# EasyEDA Pro project ProPrj_CLOCK_2026-02-21.epro

# Schematic Schematic1
Board Name: Board1; Create Date: 2025-11-06; Page Name: P1; Project Name: CLOCK; Schematic Name: Schematic1; Update Date: 2025-11-06; Company: EasyEDA.com; Page Size: A4; Version: V1.0
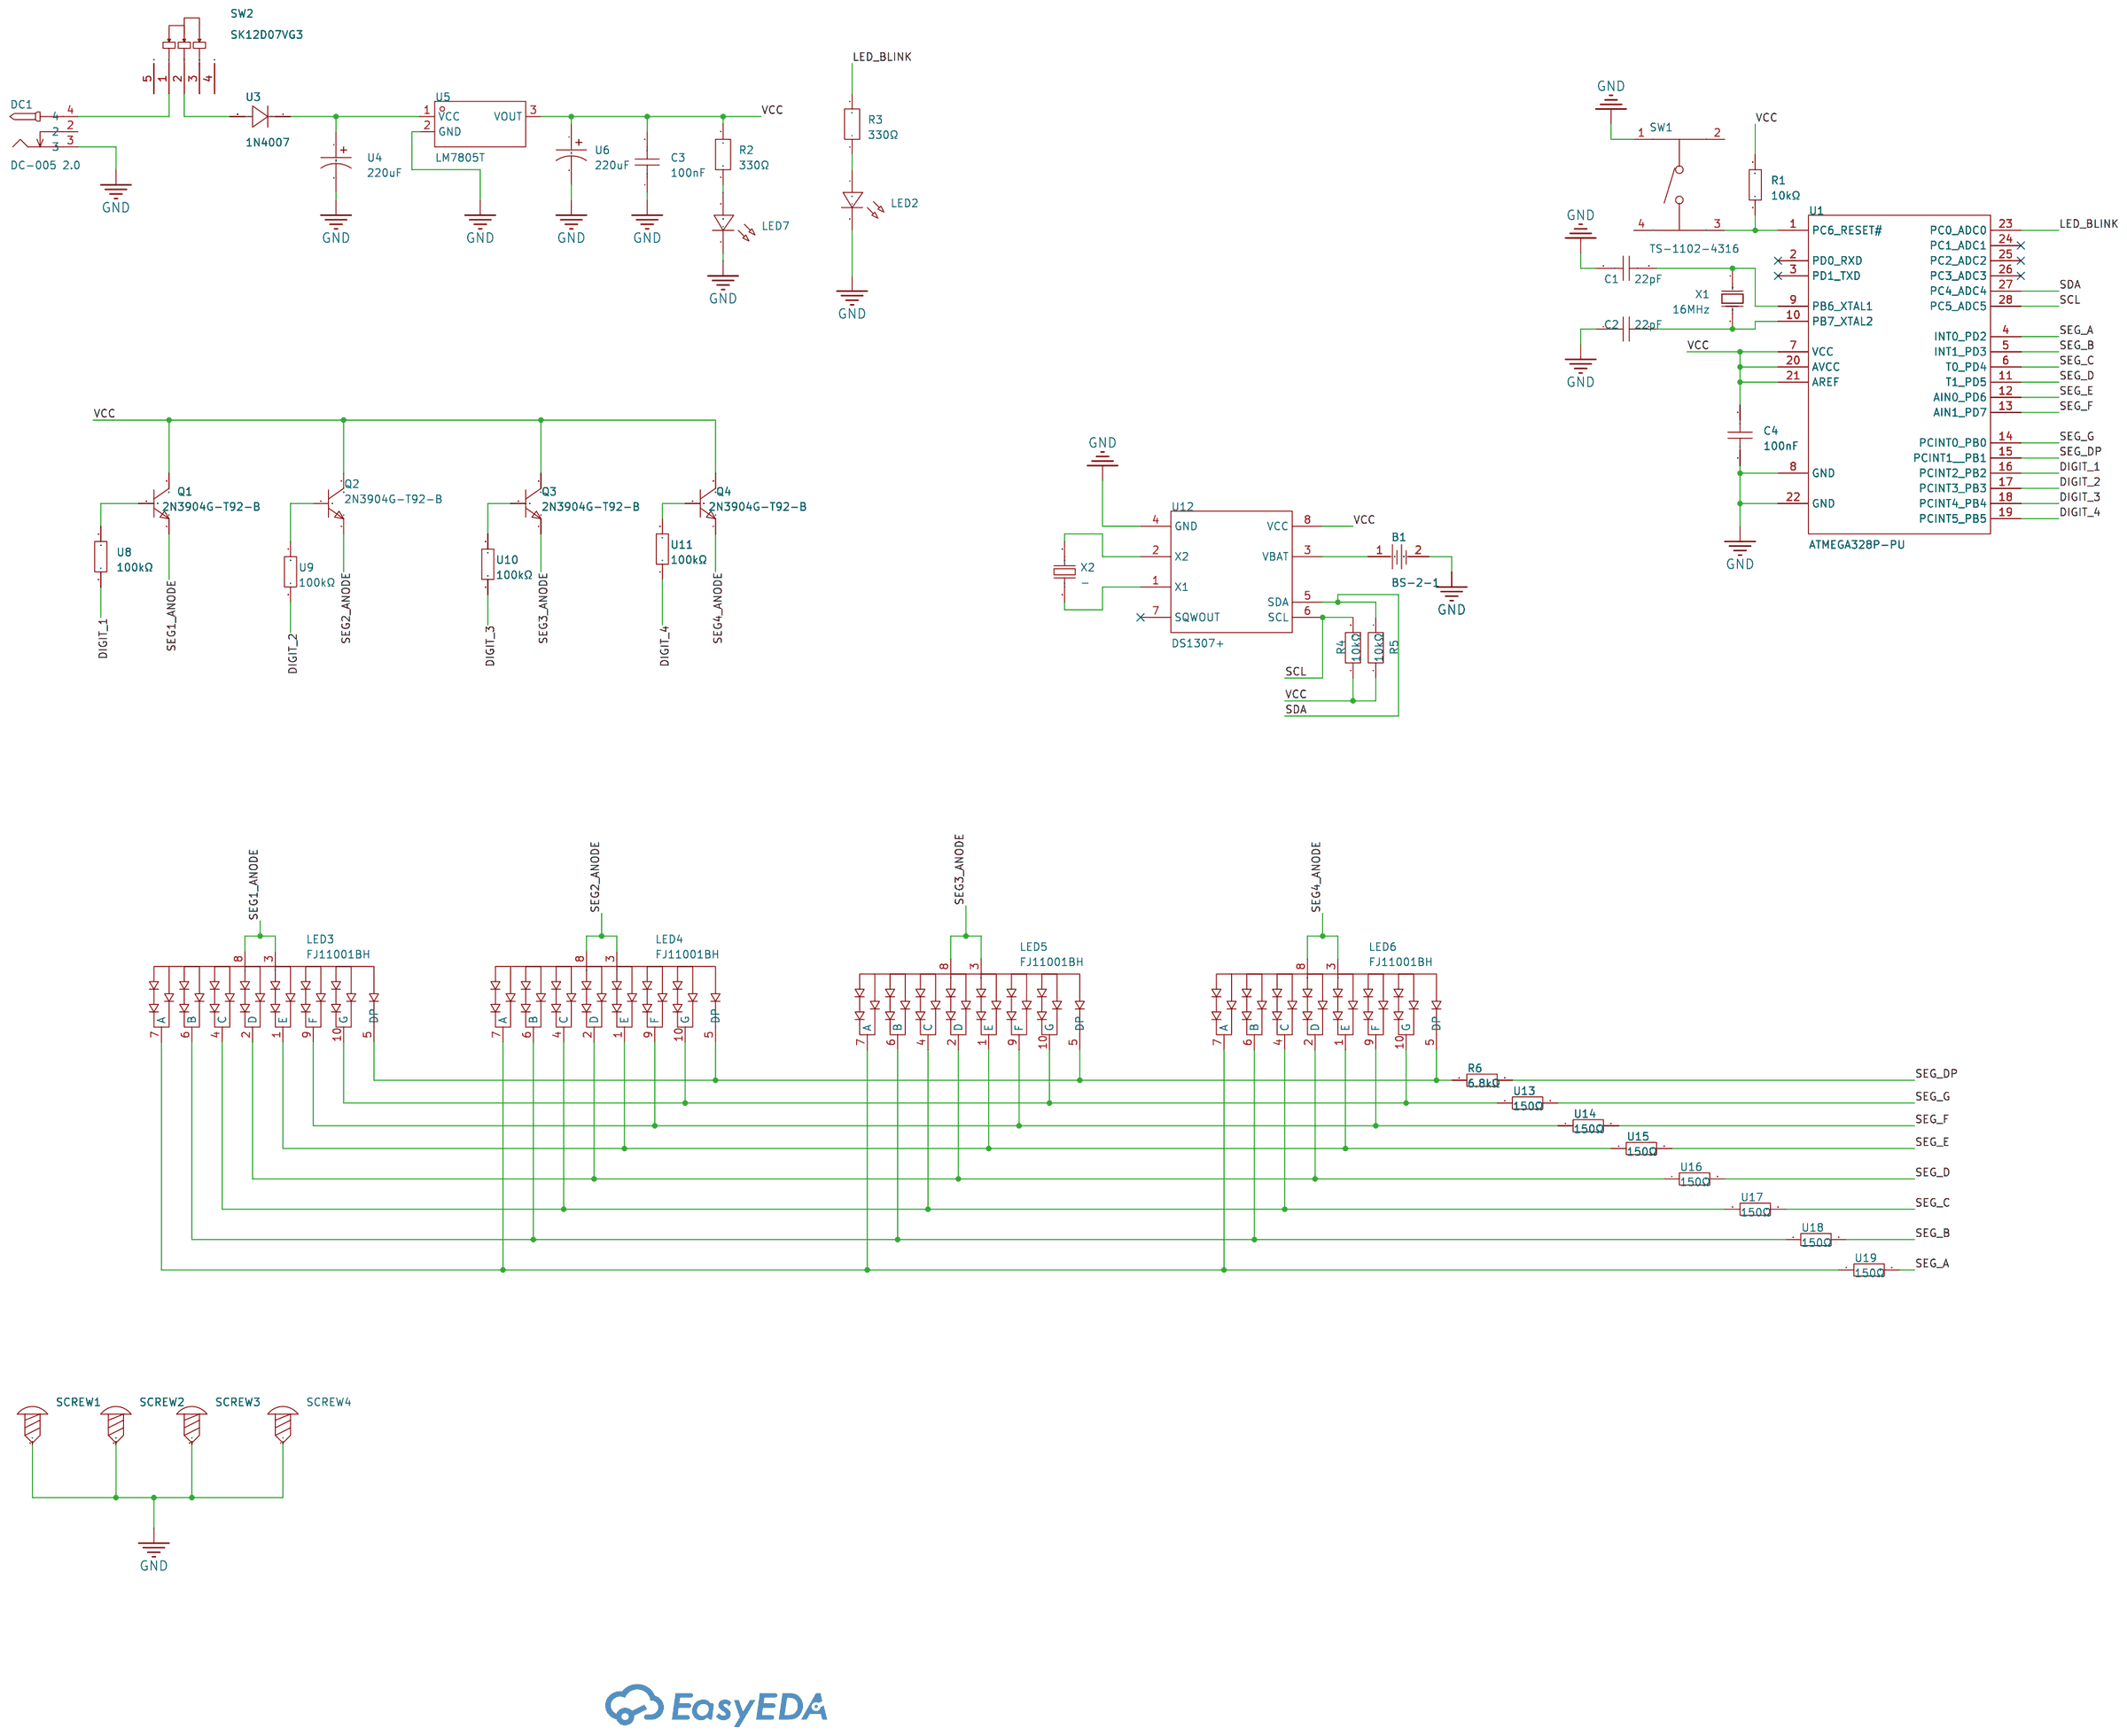
[diagram p0: schematic sheet]

## Parts
B1  BS-2-1  [BAT-TH_BS-2-1]
C1  22pF  [CAP-TH_L5.8-W2.4-P2.54-D0.6]
C2  22pF  [CAP-TH_L5.8-W2.4-P2.54-D0.6]
C3  100nF  [CAP-TH_L5.0-W2.5-P5.00-D1.0]
C4  100nF  [CAP-TH_L5.0-W2.5-P5.00-D1.0]
DC1  DC-005 2.0  [DC-IN-TH_DC-005-5.5-2.0]
LED2  -  [LED-TH_BD3.0-P2.54-FD]
LED3  FJ11001BH  [LED-SEG-TH_10P-L34.0-W24.0-P2.54-S30.48-BL]
LED4  FJ11001BH  [LED-SEG-TH_10P-L34.0-W24.0-P2.54-S30.48-BL]
LED5  FJ11001BH  [LED-SEG-TH_10P-L34.0-W24.0-P2.54-S30.48-BL]
LED6  FJ11001BH  [LED-SEG-TH_10P-L34.0-W24.0-P2.54-S30.48-BL]
LED7  -  [LED-TH_BD3.0-P2.54-FD]
Q1  2N3904G-T92-B  [TO-92-3_L4.9-W3.7-P1.27-L]
Q2  2N3904G-T92-B  [TO-92-3_L4.9-W3.7-P1.27-L]
Q3  2N3904G-T92-B  [TO-92-3_L4.9-W3.7-P1.27-L]
Q4  2N3904G-T92-B  [TO-92-3_L4.9-W3.7-P1.27-L]
R1  10kΩ  [RES-TH_BD3.3-L9.0-P13.00-D0.6]
R2  330Ω  [RES-TH_BD2.7-L6.2-P10.20-D0.4]
R3  330Ω  [RES-TH_BD2.7-L6.2-P10.20-D0.4]
R4  10kΩ  [RES-TH_BD2.7-L6.2-P10.20-D0.4]
R5  10kΩ  [RES-TH_BD2.7-L6.2-P10.20-D0.4]
R6  6.8kΩ  [RES-TH_BD2.3-L6.5-P10.50-D0.5]
SCREW1  -  [Screw-Hole-M3]
SCREW2  -  [Screw-Hole-M3]
SCREW3  -  [Screw-Hole-M3]
SCREW4  -  [Screw-Hole-M3]
SW1  TS-1102-4316  [KEY-TH_4P-L6.0-W6.0-P4.50-LS6.5]
SW2  SK12D07VG3  [SW-TH_SK12D07VG3]
U1  ATMEGA328P-PU  [DIP-28_L34.6-W7.3-P2.54-LS10.2-BL]
U3  1N4007  [DO-41_BD2.4-L4.7-P8.70-D0.6-RD]
U4  220uF  [CAP-TH_BD6.3-P2.50-D0.6-FD]
U5  LM7805T  [TO-220-3_L10.1-W4.7-P2.54-L]
U6  220uF  [CAP-TH_BD6.3-P2.50-D0.6-FD]
U8  100kΩ  [RES-TH_BD2.7-L6.2-P10.20-D0.4]
U9  100kΩ  [RES-TH_BD2.7-L6.2-P10.20-D0.4]
U10  100kΩ  [RES-TH_BD2.7-L6.2-P10.20-D0.4]
U11  100kΩ  [RES-TH_BD2.7-L6.2-P10.20-D0.4]
U12  DS1307+  [DIP-8_L9.8-W6.6-P2.54-LS7.6-BL]
U13  150Ω  [RES-TH_BD2.7-L6.2-P10.20-D0.4]
U14  150Ω  [RES-TH_BD2.7-L6.2-P10.20-D0.4]
U15  150Ω  [RES-TH_BD2.7-L6.2-P10.20-D0.4]
U16  150Ω  [RES-TH_BD2.7-L6.2-P10.20-D0.4]
U17  150Ω  [RES-TH_BD2.7-L6.2-P10.20-D0.4]
U18  150Ω  [RES-TH_BD2.7-L6.2-P10.20-D0.4]
U19  150Ω  [RES-TH_BD2.7-L6.2-P10.20-D0.4]
X1  16MHz  [OSC-TH_L10.0-W4.5-P5.00]
X2  -  [OSC-TH_BD3.0-P1.10-D0.4]

## Library data of the parts
B1 = BS-2-1_C70376: Connector Type:Battery Holder Battery Type:- Operating Temperature:-55℃~+85℃ Operating Temperature:-55℃~+85℃; LCSC Part Name: 电池底座; Supplier Part: C70376; Manufacturer: QIJEY; Supplier Footprint: 插件; JLCPCB Part Class: Extended Part; Datasheet: https://item.szlcsc.com/datasheet/BS-2-1/71471.html; Supplier: LCSC; Connector Type: Battery Holder; Operating Temperature: -55℃~+85℃
C1 C2 = CC1H220KA1EDCH4B1100: Capacitance:22pF Tolerance:±10% Tolerance:±10% Voltage Rating:50V Pin Spacing:2.54mm Temperature Coefficient:NP0 Diameter:4.8mm Body Thickness:2.4mm; LCSC Part Name: 22pF ±10% 50V; Supplier Part: C2832510; Manufacturer: Dersonic(德尔创); Supplier Footprint: 插件,P=2.54mm; JLCPCB Part Class: Extended Part; Datasheet: https://item.szlcsc.com/datasheet/CC1H220KA1EDCH4B1100/2990648.html; Supplier: LCSC; Tolerance: ±10%; Voltage Rating: 50V; Pin Spacing: 2.54mm; Temperature Coefficient: NP0; Diameter: 4.8mm; Body Thickness: 2.4mm
C3 C4 = CC1H104MC1FD3F6C10MF: Capacitance:100nF Tolerance:±20% Tolerance:±20% Voltage Rating:50V Pin Spacing:5.08mm Temperature Coefficient:Y5V Diameter:6mm Body Thickness:2.2mm; LCSC Part Name: 100nF ±20% 50V; Supplier Part: C254085; Manufacturer: Dersonic(德尔创); Supplier Footprint: 插件,P=5.08mm; JLCPCB Part Class: Extended Part; Datasheet: https://item.szlcsc.com/datasheet/CC1H104MC1FD3F6C10MF/248635.html; Supplier: LCSC; Tolerance: ±20%; Voltage Rating: 50V; Pin Spacing: 5.08mm; Temperature Coefficient: Y5V; Diameter: 6mm; Body Thickness: 2.2mm
DC1 = DC-005 2.0: Connector Type:DC Power Jack Mounting Type:Right Angle Inside Contact Diameter:2mm Outside Contact Diameter:6.4mm Current Rating:1A Voltage Rating (Max):12V Operating Temperature:-25℃~+85℃ Operating Temperature:-25℃~+85℃; LCSC Part Name: DC电源插座 内径:2mm 外径:6.4mm; Supplier Part: C16214; Manufacturer: BOOMELE(博穆精密); Supplier Footprint: 插件; JLCPCB Part Class: Extended Part; Datasheet: https://item.szlcsc.com/datasheet/DC-005%25202.0/16896.html; Supplier: LCSC; Connector Type: DC Power Jack; Mounting Type: Right Angle; Inside Contact Diameter: 2mm; Outside Contact Diameter: 6.4mm; Current Rating: 1A; Voltage Rating (Max): 12V; Operating Temperature: -25℃~+85℃
LED2 = LED_TH-G_3mm: Supplier Footprint: Through
LED3-LED6 = FJ11001BH: Digit/Alpha Size(inch):1 Illumination Color:Red LED Polarity:Common Anode; LCSC Part Name: 1英寸红色数码管 共阳极; Supplier Part: C12189; Manufacturer: 志浩; Supplier Footprint: 插件; JLCPCB Part Class: Extended Part; Datasheet: https://item.szlcsc.com/datasheet/FJ11001BH/12801.html; Supplier: LCSC; Digit/Alpha Size(inch): 1; Illumination Color: Red; LED Polarity: Common Anode
LED7 = LED_TH-R_3mm: Supplier Footprint: Through
Q1-Q4 = 2N3904G-T92-B: type:NPN Current - Collector(Ic):200mA Collector - Emitter Voltage VCEO:40V Pd - Power Dissipation:625mW DC Current Gain:100@10mA,1V DC Current Gain:100@10mA,1V Transition frequency(fT):300MHz Current - Collector Cutoff:50nA Vce Saturation(VCE(sat)):300mV; LCSC Part Name: NPN 电流:200mA 电压:40V; Supplier Part: C258453; Manufacturer: UTC(友顺); Supplier Footprint: TO-92; JLCPCB Part Class: Extended Part; Datasheet: https://item.szlcsc.com/datasheet/2N3904G-T92-B/251377.html; Supplier: LCSC; type: NPN; Current - Collector(Ic): 200mA; Collector - Emitter Voltage VCEO: 40V; Pd - Power Dissipation: 625mW; DC Current Gain: 100@10mA,1V; Transition frequency(fT): 300MHz; Current - Collector Cutoff: 50nA; Vce Saturation(VCE(sat)): 300mV@50mA,5mA; Operating Temperature: -55℃~+150℃; Emitter-Base Voltage(Vebo): 6V; Number: 1 NPN
R1 = Res_AXIAL-1/2W: Supplier Footprint: Through
R2 R3 = CR1/4W-330Ω±5%-OT52: Type:Carbon Film Resistor Resistance:330Ω Tolerance:±5% Tolerance:±5% Voltage-Supply(Max):250V Power(Watts):250mW Temperature Coefficient:±350ppm/℃ Temperature Coefficient:±350ppm/℃ Operating Temperature:-55℃~+155℃ Operating Temperature:-55℃~+155℃; LCSC Part Name: 碳膜电阻 330Ω ±5% 250mW 0.4镀锡铜脚 编带内跨距52MM; Supplier Part: C2894590; Manufacturer: VO(翔胜); Supplier Footprint: 插件,D2.7xL6.2mm; JLCPCB Part Class: Extended Part; Datasheet: https://atta.szlcsc.com/upload/public/pdf/source/20210803/C2857407_45FF53FE186CAB545115AD37303966CD.pdf; Supplier: LCSC; Type: Carbon Film Resistor; Tolerance: ±5%; Voltage-Supply(Max): 250V; Power(Watts): 250mW; Temperature Coefficient: ±350ppm/℃; Operating Temperature: -55℃~+155℃
R4 R5 = MF1/4W-10K±1%-ST52: Type:Metal Film Resistor Resistance:10kΩ Tolerance:±1% Tolerance:±1% Voltage-Supply(Max):250V Power(Watts):250mW Temperature Coefficient:±100ppm/℃ Temperature Coefficient:±100ppm/℃ Operating Temperature:-55℃~+155℃ Operating Temperature:-55℃~+155℃; LCSC Part Name: 金属膜电阻 10kΩ ±1% 250mW; Supplier Part: C2903232; Manufacturer: VO(翔胜); Supplier Footprint: 插件,D2.7xL6.2mm; JLCPCB Part Class: Extended Part; Datasheet: https://item.szlcsc.com/datasheet/MF1%252F4W-10K%25C2%25B11%2525-ST52/3158983.html; Supplier: LCSC; Type: Metal Film Resistor; Tolerance: ±1%; Voltage-Supply(Max): 250V; Power(Watts): 250mW; Temperature Coefficient: ±100ppm/℃; Operating Temperature: -55℃~+155℃
R6 = MF1/2WS-6.8KΩ±1% T: Type:Metal Film Resistor Resistance:6.8kΩ Tolerance:±1% Tolerance:±1% Voltage-Supply(Max):250V Power(Watts):500mW Temperature Coefficient:±100ppm/℃ Temperature Coefficient:±100ppm/℃ Operating Temperature:-55℃~+155℃ Operating Temperature:-55℃~+155℃; LCSC Part Name: 6.8kΩ ±1% 500mW 金属膜电阻 小体积,圆柱直插; Supplier Part: C129911; Manufacturer: CCO(千志电子); Supplier Footprint: 插件,D2.3xL6.5mm; JLCPCB Part Class: Extended Part; Datasheet: https://item.szlcsc.com/datasheet/MF1%252F2WS-6.8K%25CE%25A9%25C2%25B11%2525%2520T/141198.html; Supplier: LCSC; Type: Metal Film Resistor; Tolerance: ±1%; Voltage-Supply(Max): 250V; Power(Watts): 500mW; Temperature Coefficient: ±100ppm/℃; Operating Temperature: -55℃~+155℃
SCREW1-SCREW4 = Screw-Hole-M3: Supplier Footprint: 插件
SW1 = TS-1102-4316: Circuit:SPST Actuator Style:Round Button Operating Force:1.6N Mounting Style:Direct Insert Switch Length:6mm Switch Width:6mm Switch Height:4.3mm Contact Current:25mA Voltage Rating (DC):24V Actuator/Cap Color:Black With Lamp:- Mechanical Life:100000 Time; LCSC Part Name: 6*6*4.3mm 直插 轻触开关; Supplier Part: C111374; Manufacturer: SOFNG(硕方); Supplier Footprint: 插件; JLCPCB Part Class: Extended Part; Datasheet: https://atta.szlcsc.com/upload/public/pdf/source/20200911/C111374_C70AFD1A656F1EADE52E4A6E5D3FC819.pdf; Supplier: LCSC; Circuit: SPST; Actuator Style: Round Button; Operating Force: 1.6N; Mounting Style: Direct Insert; Switch Length: 6mm; Switch Width: 6mm; Switch Height: 4.3mm; Contact Current: 25mA; Voltage Rating (DC): 24V; Actuator/Cap Color: Black; Mechanical Life: 100000 Times; Operating Temperature: -40℃~+85℃
SW2 = SK12D07VG3_C431547: Circuit:SPDT Actuator Style:- Termination Style:PC Pin Length:8.7mm Width:4.4mm Switch Height:4.7mm Mounting Type:- Actuator Color:- Current Rating:500mA Voltage Rating:50V Life:5000 Cycles Operating Temperature:-10℃~+50℃ Operating Temperature:-10℃~+50℃; LCSC Part Name: 两档位卧式拨动开关,柄长3MM; Supplier Part: C431547; Manufacturer: SHOU HAN(首韩); Supplier Footprint: 插件,8.7x4.4mm; JLCPCB Part Class: Extended Part; Datasheet: https://item.szlcsc.com/datasheet/SK12D07VG3/427904.html; Supplier: LCSC; Circuit: SPDT; Termination Style: PC Pin; Length: 8.7mm; Width: 4.4mm; Switch Height: 4.7mm; Current Rating: 500mA; Voltage Rating: 50V; Life: 5000 Cycles; Operating Temperature: -10℃~+50℃
U1 = ATMEGA328P-PU: CPU Core:AVR CPU Maximum Speed:20MHz Program Storage Size:32KB Program Memory Type:FLASH Number of I/O:23 ADC (Bit):10bit Voltage - Supply:1.8V~5.5V Voltage - Supply:1.8V~5.5V Applications:-; LCSC Part Name: MSL=1 基于AVR增强型RISC架构的低功耗CMOS 8位微控制器; Supplier Part: C33901; Manufacturer: MICROCHIP(美国微芯); Supplier Footprint: DIP-28-300mil; JLCPCB Part Class: Extended Part; Datasheet: https://item.szlcsc.com/datasheet/ATMEGA328P-PU/34869.html; Supplier: LCSC; CPU Core: AVR; CPU Maximum Speed: 20MHz; Program Storage Size: 32KB; Program Memory Type: FLASH; Number of I/O: 23; ADC (Bit): 10bit; Voltage - Supply: 1.8V~5.5V
U3 = 1N4007_C5261026: Voltage - Forward(Vf@If):1.1V@1A Voltage - DC Reverse(Vr):1kV Current - Rectified:1A Reverse Leakage Current (Ir):5uA@1000V Non-Repetitive Peak Forward Surge Current:30A Operating Junction Temperature Range:-55℃~+150℃ Operating Junction Temperature Range:; Supplier Part: C5261026; Manufacturer: CJ(江苏长电/长晶); Supplier Footprint: DO-41; JLCPCB Part Class: Extended Part; Datasheet: https://item.szlcsc.com/datasheet/1N4007/5983537.html; Supplier: LCSC; Voltage - Forward(Vf@If): 1.1V@1A; Voltage - DC Reverse(Vr): 1kV; Current - Rectified: 1A; Reverse Leakage Current (Ir): 5uA@1000V; Non-Repetitive Peak Forward Surge Current: 30A; Operating Junction Temperature Range: -55℃~+150℃
U4 U6 = 25V220uF CD288: Capacitance:220uF Tolerance:±20% Tolerance:±20% Voltage Rating:25V Pin Spacing:2.5mm Diameter:6.3mm Height - Seated (Max):12mm Operating Temperature:-40℃~+105℃ Operating Temperature:-40℃~+105℃; LCSC Part Name: 220uF ±20% 25V; Supplier Part: C2960221; Manufacturer: HRK(鸿瑞凯电子); Supplier Footprint: 插件,D6.3xL12mm; JLCPCB Part Class: Extended Part; Supplier: LCSC; Tolerance: ±20%; Voltage Rating: 25V; Pin Spacing: 2.5mm; Diameter: 6.3mm; Height - Seated (Max): 12mm; Operating Temperature: -40℃~+105℃
U5 = LM7805T_C7432180: Supplier Part: C7432180; Manufacturer: HGSEMI(华冠); Supplier Footprint: TO-220-3; JLCPCB Part Class: Extended Part; Datasheet: https://atta.szlcsc.com/upload/public/pdf/source/20240307/E28367F2CC2BC825DF756EF02CE1AF99.pdf; Supplier: LCSC
U8-U11 = MF1/4W-100K±1%-OT26: Type:Metal Film Resistors Resistance: Tolerance:±1% Tolerance:±1% Overload Voltage (Max):250V Power(Watts):250mW Temperature Coefficient:±350ppm/℃ Temperature Coefficient:±350ppm/℃ Operating Temperature Range:-55℃~+155℃ Operating Temperature Range:-55℃~+1; LCSC Part Name: 金属膜电阻 100kΩ ±1% 250mW; Supplier Part: C2843019; Manufacturer: VO(翔胜); Supplier Footprint: 插件,D2.7xL6.2mm; JLCPCB Part Class: Extended Part; Datasheet: https://atta.szlcsc.com/upload/public/pdf/source/20200609/C601728_5AA4C0C8E12E11069DA2C3356F29D1F2.pdf; Supplier: LCSC; Type: Metal Film Resistors; Tolerance: ±1%; Overload Voltage (Max): 250V; Power(Watts): 250mW; Temperature Coefficient: ±350ppm/℃; Operating Temperature Range: -55℃~+155℃
U12 = DS1307+: Interface:I2C Voltage - Supply:4.5V~5.5V Voltage - Supply:4.5V~5.5V Operating Temperature:0℃~+70℃ Operating Temperature:0℃~+70℃; LCSC Part Name: 64 x 8，串行，I2C 实时时钟; Supplier Part: C59267; Manufacturer: ADI(亚德诺)/MAXIM(美信); Supplier Footprint: DIP-8; JLCPCB Part Class: Extended Part; Datasheet: https://atta.szlcsc.com/upload/public/pdf/source/20170810/C59267_1502335389361879977.pdf; Supplier: LCSC; Interface: I2C; Voltage - Supply: 4.5V~5.5V; Operating Temperature: 0℃~+70℃
U13-U19 = KNP1WS-150Ω±5%-XT52: Type:Wirewound Resistors Resistance: Tolerance:±5% Tolerance:±5% Overload Voltage (Max):350V Power(Watts):1W Temperature Coefficient:±350ppm/℃ Temperature Coefficient:±350ppm/℃ Operating Temperature Range:-55℃~+155℃ Operating Temperature Range:-55℃~+155℃; LCSC Part Name: 绕线电阻 150Ω ±5% 1W; Supplier Part: C479230; Manufacturer: VO(翔胜); Supplier Footprint: 插件,D3.5xL9mm; JLCPCB Part Class: Extended Part; Datasheet: https://atta.szlcsc.com/upload/public/pdf/source/20200609/C601736_823D5FEC32C33ED68EDB1181C52D1F38.pdf; Supplier: LCSC; Type: Wirewound Resistors; Tolerance: ±5%; Overload Voltage (Max): 350V; Power(Watts): 1W; Temperature Coefficient: ±350ppm/℃; Operating Temperature Range: -55℃~+155℃
X1 = X49SD16MSD2SC: Type:Through-Hole Crystal Oscillator Frequency:16MHz Normal temperature Frequency Tolerance:±20ppm Normal temperature Frequency Tolerance:±20ppm Load Capacitance:20pF Frequency Stability:±30ppm Frequency Stability:±30ppm Operating Temperature:-20℃~+70℃ Op; LCSC Part Name: HC-49US 16MHZ 2P 49S 20PF ±20PPM -20~70℃ (±30PPM); Supplier Part: C16212; Manufacturer: YXC(扬兴晶振); Supplier Footprint: HC-49S; JLCPCB Part Class: Extended Part; Datasheet: https://item.szlcsc.com/datasheet/X49SD16MSD2SC/16894.html; Supplier: LCSC; Type: Through-Hole Crystal Oscillator; Normal temperature Frequency Tolerance: ±20ppm; Load Capacitance: 20pF; Frequency Stability: ±30ppm; Operating Temperature: -20℃~+70℃
X2 = DT-38 32.768KHz: Type:- Frequency:- Load Capacitance:- Operating Temperature:- Operating Temperature:-; LCSC Part Name: 32.768KHz 12.5PF 20ppm; Supplier Part: C93228; Manufacturer: KDS(大真空); Supplier Footprint: DT-38; JLCPCB Part Class: Extended Part; Datasheet: https://item.szlcsc.com/datasheet/DT-38%252032.768KHz/94423.html; Supplier: LCSC

## Nets
GND: B1.2 C1.1 C2.1 C3.1 C4.1 DC1.3 LED2.2(A) LED7.2(A) SCREW1.1 SCREW2.1 SCREW3.1 SCREW4.1 SW1.1 U1.8(GND) U1.22(GND) U4.2 U5.2(GND) U6.2 U12.4(GND)
VCC: C3.2 C4.2 Q1.3(C) Q2.3(C) Q3.3(C) Q4.3(C) R1.2 R2.2 R4.1 R5.2 U1.7(VCC) U1.20(AVCC) U1.21(AREF) U5.3(VOUT) U6.1 U12.8(VCC)
DIGIT_1: U1.16(PCINT2 PB2) U8.1
DIGIT_2: U1.17(PCINT3 PB3) U9.1
DIGIT_3: U1.18(PCINT4 PB4) U10.1
DIGIT_4: U1.19(PCINT5 PB5) U11.1
LED_BLINK: R3.2 U1.23(PC0 ADC0)
SCL: R4.2 U1.28(PC5 ADC5) U12.6(SCL)
SDA: R5.1 U1.27(PC4 ADC4) U12.5(SDA)
SEG1_ANODE: LED3.3 LED3.8(11) Q1.1(E)
SEG2_ANODE: LED4.3 LED4.8(11) Q2.1(E)
SEG3_ANODE: LED5.3 LED5.8(11) Q3.1(E)
SEG4_ANODE: LED6.3 LED6.8(11) Q4.1(E)
SEG_A: U1.4(INT0 PD2) U19.2
SEG_B: U1.5(INT1 PD3) U18.2
SEG_C: U1.6(T0 PD4) U17.2
SEG_D: U1.11(T1 PD5) U16.2
SEG_DP: R6.2 U1.15(PCINT1  PB1)
SEG_E: U1.12(AIN0 PD6) U15.2
SEG_F: U1.13(AIN1 PD7) U14.2
SEG_G: U1.14(PCINT0 PB0) U13.2
$1N511: R1.1 SW1.3 U1.1(PC6 RESET#)
$1N849: C2.2 U1.10(PB7 XTAL2) X1.2(OSC2)
$1N855: C1.2 U1.9(PB6 XTAL1) X1.1(OSC1)
$1N1324: SW2.2 U3.2(A)
$1N1483: U3.1(C) U4.1 U5.1(VCC)
$1N2466: Q1.2(B) U8.2
$1N2538: Q2.2(B) U9.2
$1N2650: Q3.2(B) U10.2
$1N2701: Q4.2(B) U11.2
$1N2822: B1.1 U12.3(VBAT)
$1N3202: U12.2(X2) X2.2
$1N3219: U12.1(X1) X2.1
$1N3541: LED3.5(DP) LED4.5(DP) LED5.5(DP) LED6.5(DP) R6.1
$1N3670: LED3.10(G) LED4.10(G) LED5.10(G) LED6.10(G) U13.1
$1N3781: LED3.9(F) LED4.9(F) LED5.9(F) LED6.9(F) U14.1
$1N3888: LED3.1(E) LED4.1(E) LED5.1(E) LED6.1(E) U15.1
$1N3982: LED3.2(D) LED4.2(D) LED5.2(D) LED6.2(D) U16.1
$1N4031: LED3.4(C) LED4.4(C) LED5.4(C) LED6.4(C) U17.1
$1N4067: LED3.6(B) LED4.6(B) LED5.6(B) LED6.6(B) U18.1
$1N4099: LED3.7(A) LED4.7(A) LED5.7(A) LED6.7(A) U19.1
Net-(DC1-4): DC1.4 SW2.1
Net-(LED2-1): LED2.1(C) R3.1
Net-(LED7-1): LED7.1(C) R2.1

Not connected (* = marked no-connect by the designer): DC1 2; SW1 2 4; SW2 3 4 5; U1 2(PD0 RXD)* 3(PD1 TXD)* 24(PC1 ADC1)* 25(PC2 ADC2)* 26(PC3 ADC3)*; U12 7(SQWOUT)*

# Board PCB1
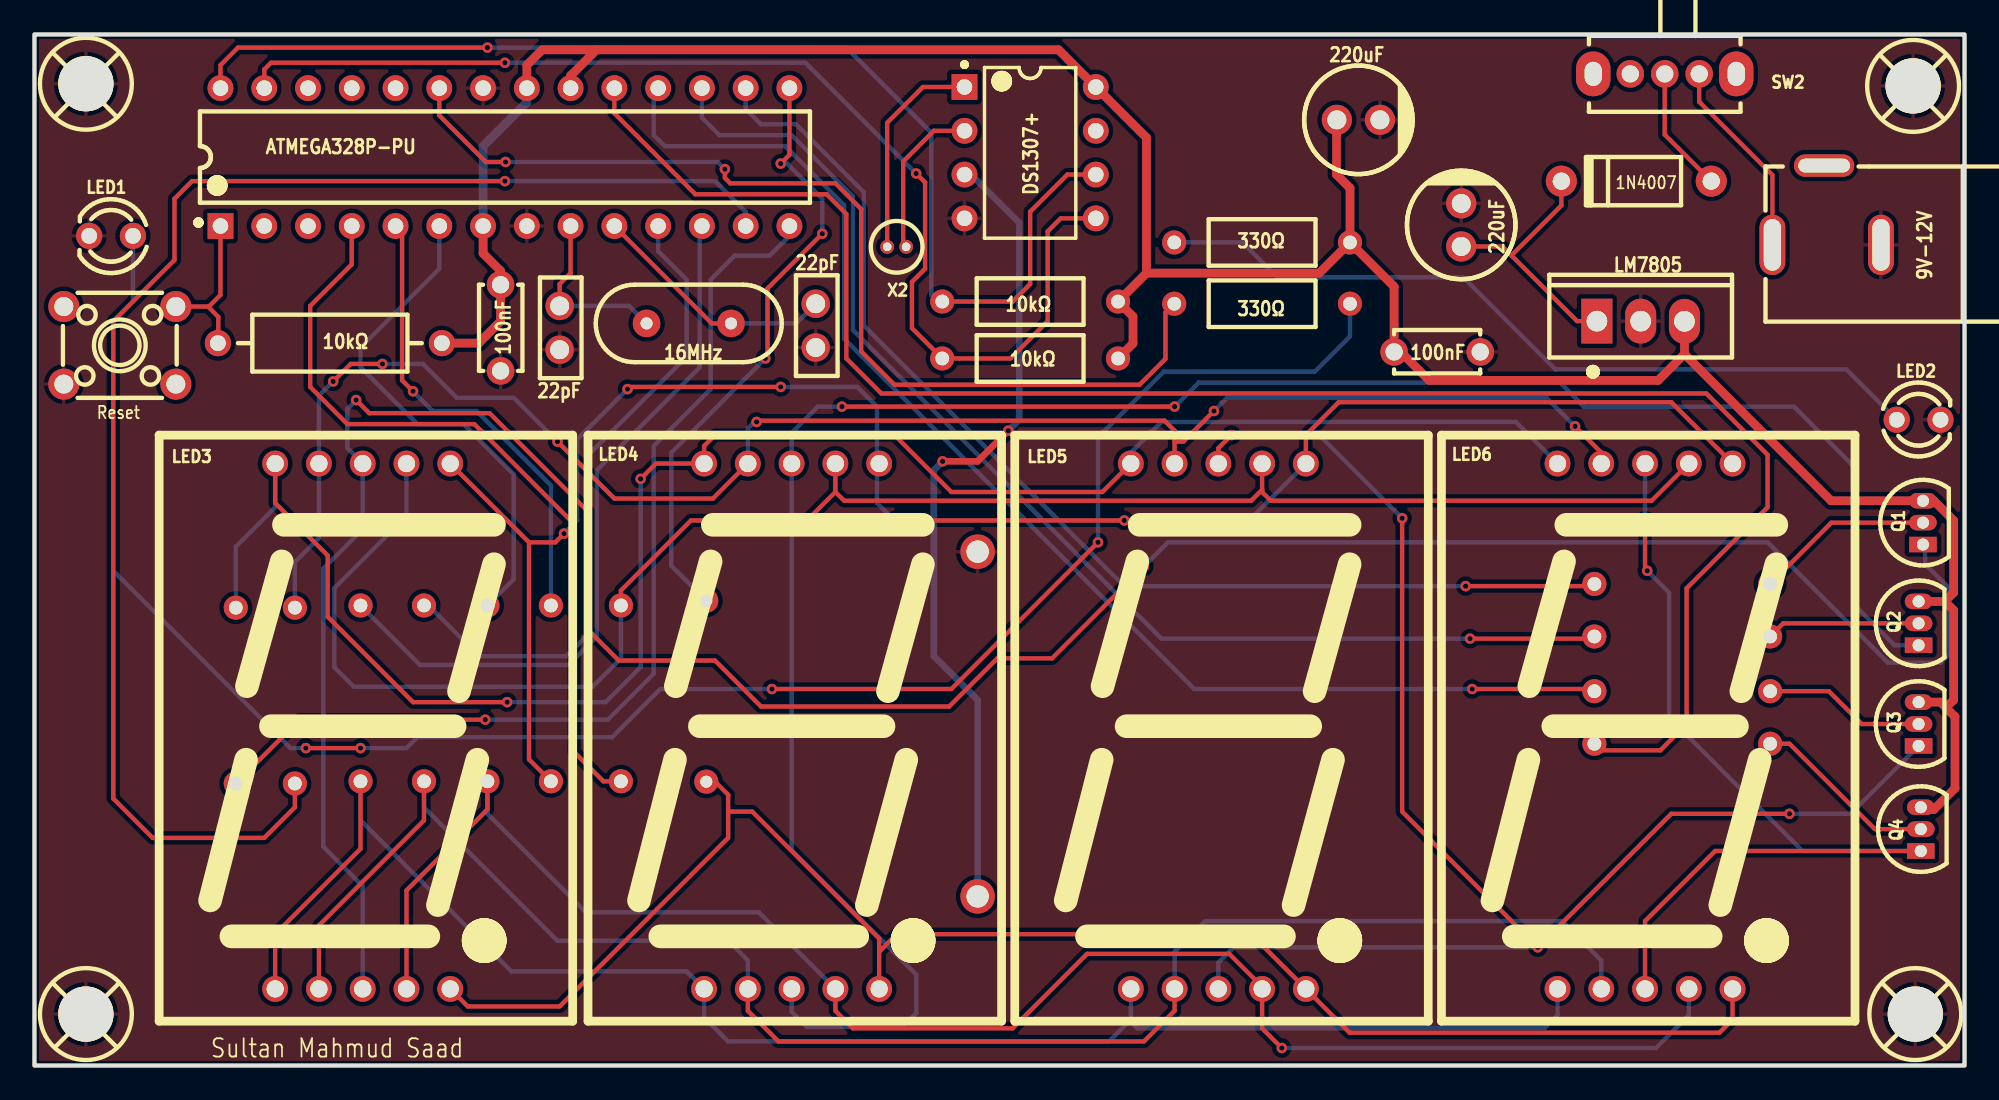
[diagram p1: board, top side]
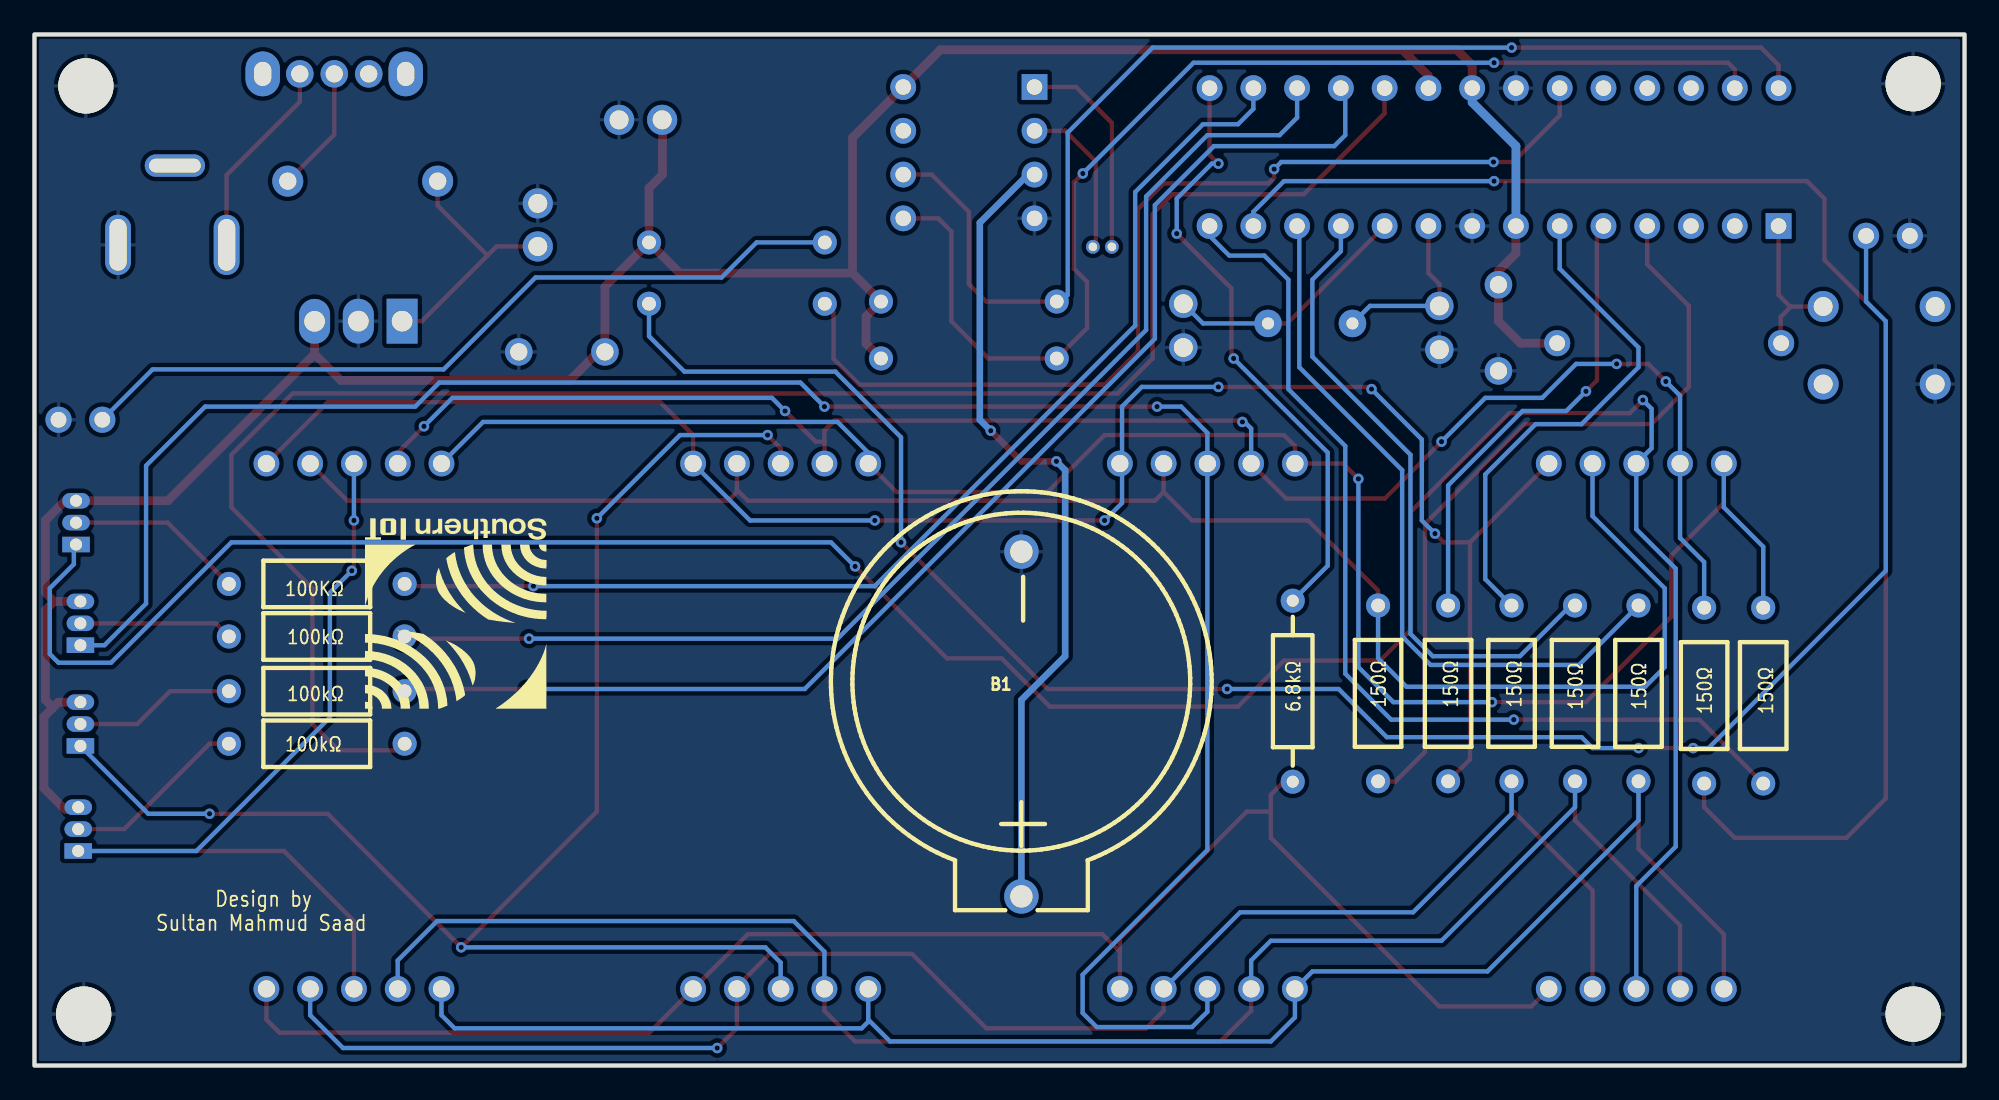
[diagram p2: board, bottom side, seen from below]

Outline 112.01 x 59.82 mm; copper layers: Top Layer, Bottom Layer. Coordinates in mm from the lower left corner of the outline.
Outline path: rectangle 0,59.82 112.01,0
Stack: Top Layer 0.035mm / Dielectric1 1.51mm FR4 er 4.5 / Bottom Layer 0.035mm

## Design rules (mm)
template: JLCPCB Capability(Two Layers Board)
spacing copperThickness1oz (default): track to track 0.102, other pairs 0.152 to 0.3
spacing copperThickness2oz: track to track 0.203, other pairs 0.152 to 0.3
track width copperThickness1oz (default): min 0.127, default 0.254, max 2.54
track width copperThickness2oz: min 0.203, default 0.254, max 2.54
differential pair differentialPair (default): width min 0.127, default 0.254, max 2.54; gap min 0.152, default 0.152
via viaSize (default): diameter min 0.5, default 0.61, max 10; hole min 0.3, default 0.305, max 6.3

## Placement (name value [footprint] x y rotation side)
9V-12V  DC-005 2.0  [DC-IN-TH_DC-005-5.5-2.0]  104.01 49.91 180 top
B1  BS-2-1  [BAT-TH_BS-2-1]  54.74 19.81 180 bottom
C1  22pF  [CAP-TH_L5.8-W2.4-P2.54-D0.6]  30.48 42.8 90 top
C2  22pF  [CAP-TH_L5.8-W2.4-P2.54-D0.6]  45.34 42.93 90 top
C3  100nF  [CAP-TH_L5.0-W2.5-P5.00-D1.0]  81.41 41.4 180 top
C4  100nF  [CAP-TH_L5.0-W2.5-P5.00-D1.0]  27.05 42.8 90 top
LED1  -  [LED-TH_BD3.0-P2.54-FD]  4.45 48.13 180 top
LED2  -  [LED-TH_BD3.0-P2.54-FD]  109.35 37.47 0 top
LED3  FJ11001BH  [LED-SEG-TH_10P-L34.0-W24.0-P2.54-S30.48-BL]  19.05 19.69 0 top
LED4  FJ11001BH  [LED-SEG-TH_10P-L34.0-W24.0-P2.54-S30.48-BL]  43.94 19.69 0 top
LED5  FJ11001BH  [LED-SEG-TH_10P-L34.0-W24.0-P2.54-S30.48-BL]  68.71 19.69 0 top
LED6  FJ11001BH  [LED-SEG-TH_10P-L34.0-W24.0-P2.54-S30.48-BL]  93.47 19.69 0 top
Q1  2N3904G-T92-B  [TO-92-3_L4.9-W3.7-P1.27-L]  109.6 31.5 90 top
Q2  2N3904G-T92-B  [TO-92-3_L4.9-W3.7-P1.27-L]  109.35 25.65 90 top
Q3  2N3904G-T92-B  [TO-92-3_L4.9-W3.7-P1.27-L]  109.35 19.81 90 top
Q4  2N3904G-T92-B  [TO-92-3_L4.9-W3.7-P1.27-L]  109.47 13.72 90 top
R1  10kΩ  [RES-TH_BD3.3-L9.0-P13.00-D0.6]  17.15 41.91 0 top
R2  330Ω  [RES-TH_BD2.7-L6.2-P10.20-D0.4]  71.25 47.75 0 top
R3  330Ω  [RES-TH_BD2.7-L6.2-P10.20-D0.4]  71.25 44.2 180 top
R4  10kΩ  [RES-TH_BD2.7-L6.2-P10.20-D0.4]  57.78 44.32 180 top
R5  10kΩ  [RES-TH_BD2.7-L6.2-P10.20-D0.4]  57.78 41.02 0 top
R6  6.8kΩ  [RES-TH_BD2.3-L6.5-P10.50-D0.5]  38.99 21.72 90 bottom
SCREW1  -  [Screw-Hole-M3]  3.05 2.92 0 top
SCREW2  -  [Screw-Hole-M3]  3.05 56.9 0 top
SCREW3  -  [Screw-Hole-M3]  109.09 56.77 0 top
SCREW4  -  [Screw-Hole-M3]  109.22 2.92 0 top
SW1  TS-1102-4316  [KEY-TH_4P-L6.0-W6.0-P4.50-LS6.5]  4.95 41.78 0 top
SW2  SK12D07VG3  [SW-TH_SK12D07VG3]  94.62 57.53 180 top
U1  ATMEGA328P-PU  [DIP-28_L34.6-W7.3-P2.54-LS10.2-BL]  27.31 52.7 0 top
U3  1N4007  [DO-41_BD2.4-L4.7-P8.70-D0.6-RD]  92.96 51.31 0 top
U4  220uF  [CAP-TH_BD6.3-P2.50-D0.6-FD]  82.8 48.77 90 top
U5  LM7805T  [TO-220-3_L10.1-W4.7-P2.54-L]  93.22 43.18 0 top
U6  220uF  [CAP-TH_BD6.3-P2.50-D0.6-FD]  76.84 54.86 0 top
U8  100kΩ  [RES-TH_BD2.7-L6.2-P10.20-D0.4]  95.63 27.94 0 bottom
U9  100kΩ  [RES-TH_BD2.7-L6.2-P10.20-D0.4]  95.63 24.89 0 bottom
U10  100kΩ  [RES-TH_BD2.7-L6.2-P10.20-D0.4]  95.63 21.72 0 bottom
U11  100kΩ  [RES-TH_BD2.7-L6.2-P10.20-D0.4]  95.63 18.67 0 bottom
U12  DS1307+  [DIP-8_L9.8-W6.6-P2.54-LS7.6-BL]  57.78 52.96 270 top
U13  150Ω  [RES-TH_BD2.7-L6.2-P10.20-D0.4]  11.68 21.46 270 bottom
U14  150Ω  [RES-TH_BD2.7-L6.2-P10.20-D0.4]  15.11 21.46 270 bottom
U15  150Ω  [RES-TH_BD2.7-L6.2-P10.20-D0.4]  18.92 21.59 90 bottom
U16  150Ω  [RES-TH_BD2.7-L6.2-P10.20-D0.4]  22.61 21.59 90 bottom
U17  150Ω  [RES-TH_BD2.7-L6.2-P10.20-D0.4]  26.29 21.59 90 bottom
U18  150Ω  [RES-TH_BD2.7-L6.2-P10.20-D0.4]  29.97 21.59 90 bottom
U19  150Ω  [RES-TH_BD2.7-L6.2-P10.20-D0.4]  34.04 21.59 270 bottom
X1  16MHz  [OSC-TH_L10.0-W4.5-P5.00]  37.97 43.05 90 top
X2  -  [OSC-TH_BD3.0-P1.10-D0.4]  50.04 47.5 0 top

## Footprints (pads in the part's own frame, mm; a bottom-side part is the same pattern mirrored in y, then rotated)
BAT-TH_BS-2-1
  round 2 hole 1.3: 1(0,-10) 2(0,10)
CAP-TH_BD6.3-P2.50-D0.6-FD
  round 1.75 hole 1.1: 1(-1.25,0) 2(1.25,0)
CAP-TH_L5.0-W2.5-P5.00-D1.0
  round 1.6 hole 1: 1(-2.5,0) 2(2.5,0)
CAP-TH_L5.8-W2.4-P2.54-D0.6
  round 1.65 hole 1.1: 1(-1.27,0) 2(1.27,0)
DC-IN-TH_DC-005-5.5-2.0
  oval 3.5x1.3 hole 3x0.8: 2(0.15,-2.3)
  oval 1.5x3.5 hole 1x3: 3(-3.15,2.3) 4(3.15,2.3)
DIP-8_L9.8-W6.6-P2.54-LS7.6-BL
  rect 1.5x1.5 hole 0.9: 1(-3.81,-3.81)
  round 1.5 hole 0.9: 2(-1.27,-3.81) 3(1.27,-3.81) 4(3.81,-3.81) 5(3.81,3.81) 6(1.27,3.81) 7(-1.27,3.81) 8(-3.81,3.81)
DIP-28_L34.6-W7.3-P2.54-LS10.2-BL
  rect 1.5x1.5 hole 0.9: 1(-16.51,-4)
  round 1.5 hole 0.9: 2(-13.97,-4) 3(-11.43,-4) 4(-8.89,-4) 5(-6.35,-4) 6(-3.81,-4) 7(-1.27,-4) 8(1.27,-4) 9(3.81,-4) 10(6.35,-4) 11(8.89,-4) 12(11.43,-4) 13(13.97,-4) 14(16.51,-4) 15(16.51,4) 16(13.97,4) 17(11.43,4) 18(8.89,4) 19(6.35,4) 20(3.81,4) 21(1.27,4) 22(-1.27,4) 23(-3.81,4) 24(-6.35,4) 25(-8.89,4) 26(-11.43,4) 27(-13.97,4) 28(-16.51,4)
DO-41_BD2.4-L4.7-P8.70-D0.6-RD
  round 1.8 hole 1: 1(-4.35,0) 2(4.35,0)
KEY-TH_4P-L6.0-W6.0-P4.50-LS6.5
  round 1.8 hole 1.1: 1(-3.251,-2.251) 2(3.251,-2.251) 3(3.251,2.251) 4(-3.251,2.251)
LED-SEG-TH_10P-L34.0-W24.0-P2.54-S30.48-BL
  round 1.5 hole 1: 1(-5.08,-15.24) 2(-2.54,-15.24) 3(0,-15.24) 4(2.54,-15.24) 5(5.08,-15.24) 6(5.08,15.24) 7(2.54,15.24) 8(0,15.24) 9(-2.54,15.24) 10(-5.08,15.24)
LED-TH_BD3.0-P2.54-FD
  round 1.524 hole 0.914: 1(-1.27,0) 2(1.27,0)
OSC-TH_BD3.0-P1.10-D0.4
  round 0.8 hole 0.5: 1(-0.55,0) 2(0.55,0)
OSC-TH_L10.0-W4.5-P5.00
  round 1.6 hole 0.7: 1(0,2.45) 2(0,-2.45)
RES-TH_BD2.3-L6.5-P10.50-D0.5
  round 1.4 hole 0.7: 1(-5.25,0) 2(5.25,0)
RES-TH_BD2.7-L6.2-P10.20-D0.4
  round 1.4 hole 0.8: 1(-5.1,0) 2(5.1,0)
RES-TH_BD3.3-L9.0-P13.00-D0.6
  round 1.524 hole 0.914: 1(-6.5,0) 2(6.5,0)
Screw-Hole-M3
  round 3.2 hole 3.2: 1(-0.064,0.064)
SW-TH_SK12D07VG3
  oval 1.6x1.6 hole 1: 1(-2,0) 2(0,0) 3(2,0)
  oval 2x2.6 hole 1x1.4: 4(4.15,0) 5(-4.15,0)
TO-92-3_L4.9-W3.7-P1.27-L
  rect 0.9x1.6 hole 0.7: 1(-1.27,0)
  oval 0.9x1.6 hole 0.7: 2(0,0) 3(1.27,0)
TO-220-3_L10.1-W4.7-P2.54-L
  rect 1.8x2.6 hole 1.2: 1(-2.54,0.005)
  oval 1.8x2.6 hole 1.2: 2(0,0.005) 3(2.54,-0.005)

## Nets
As in the schematic, except:
GND: 9V-12V.3 B1.2 C1.1 C2.1 C3.1 C4.1 LED1.2 LED2.2 SCREW1.1 SCREW2.1 SCREW3.1 SCREW4.1 SW1.1 U1.8 U1.22 U4.2 U5.2 U6.2 U12.4
$1N1319: 9V-12V.4 SW2.1
$1N1989: LED2.1 R2.1
$1N2086: LED1.1 R3.1

Pads without a net: 9V-12V 2; SW1 2 4; SW2 3 4 5; U1 2 3 24 25 26; U12 7

## Via types
v1: diameter 0.61, hole 0.305, Top Layer to Bottom Layer, 44 vias

## Routing (per net, layer and track width the routed paths; a pad name or vN(x,y) marks a point on that pad's centre or on a via; arc(x,y) is an arc through that point)
VCC: length 165
  Top Layer w0.508: R1.2 25.78,41.91 27.05,43.18 C4.2 27.05,46.1 26.04,47.12 U1.7 ; 32.62,58.93 31.12,57.42 U1.20 ; 32.62,58.93 29.46,58.93 28.58,58.04 U1.21 ; 32.62,58.93 59.44,58.93 U12.8 64.54,53.83 64.54,45.97 ; 110.87,26.92 111.38,27.43 111.38,31.62 110.24,32.77 Q1.3 104.27,32.77 95.76,41.28 ; 110.87,26.92 111.38,26.42 111.38,21.21 111,20.83 111,20.7 ; 110.87,26.92 Q2.3 ; 111,20.7 110.62,21.08 Q3.3 ; 111,20.7 111.46,20.24 111.46,16.08 110.24,14.86 109.6,14.86 Q4.3 ; R2.2 76.35,50.91 75.56,51.69 75.56,54.84 U6.1 ; R2.2 78.91,45.19 C3.2 79.29,41.4 80.94,39.75 94.23,39.75 95.76,41.28 ; R2.2 74.57,45.97 64.54,45.97 ; 64.54,45.97 R4.1 63.75,43.45 63.75,41.89 R5.2 ; U5.3 95.76,41.28
  Bottom Layer w0.508: U1.7 26.04,53.34 28.58,55.88 U1.21
DIGIT_1: length 66.5
  Top Layer w0.254: U8.1 90.4,27.81 v1(83.06,27.81)
  Bottom Layer w0.254: U1.16 41.28,55.5 42.16,54.61 44.2,54.61 48.13,50.67 48.13,42.93 63.25,27.81 v1(83.06,27.81)
DIGIT_2: length 70.6
  Top Layer w0.254: v1(83.31,24.77) 90.4,24.77 U9.1
  Bottom Layer w0.254: v1(83.31,24.77) 65.41,24.77 47.5,42.67 47.5,50.42 43.94,53.98 39.75,53.98 38.74,54.99 U1.17
DIGIT_3: length 75.3
  Top Layer w0.254: v1(83.44,21.84) 90.4,21.84 U10.1
  Bottom Layer w0.254: U1.18 35.94,56.45 35.94,53.98 36.58,53.34 43.56,53.34 46.99,49.91 46.99,42.16 67.31,21.84 v1(83.44,21.84)
DIGIT_4: length 105.2
  Top Layer w0.254: U11.1 90.91,18.29 94.36,18.29 95.89,19.81 95.89,27.69 100.58,32.39 100.58,35.43 97.03,38.99 49.15,38.99 47.12,41.02 47.12,49.4 45.97,50.55 38.35,50.55 33.66,55.25 U1.19
LED_BLINK: length 59.4
  Top Layer w0.254: v1(27.34,52.42) 26.19,52.42 23.5,55.12 U1.23 ; R3.2 65.64,43.69 65.64,41 64.14,39.5 49.91,39.5 47.98,41.43 47.98,49.68 46.48,51.18 40.39,51.18 40.07,51.5 v1(40.07,52.01)
  Bottom Layer w0.254: v1(27.34,52.42) 39.66,52.42 v1(40.07,52.01)
SCL: length 69.7
  Top Layer w0.254: v1(26.29,59.06) 11.81,59.06 10.8,58.04 U1.28 ; U12.6 59.94,51.69 57.78,49.53 57.78,45.34 56.77,44.32 R4.2
  Bottom Layer w0.254: R4.2 52.43,44.32 52.05,44.7 52.05,54.12 47.12,59.06 v1(26.29,59.06)
SDA: length 69.1
  Top Layer w0.254: v1(27.31,58.18) 13.73,58.18 13.34,57.79 U1.27 ; U12.5 59.56,49.15 58.8,48.39 58.8,43.18 56.64,41.02 R5.1 50.93,42.78 50.93,45.47 51.69,46.23 51.69,51.24 v1(51.17,51.75)
  Bottom Layer w0.254: v1(27.31,58.18) 44.75,58.18 v1(51.17,51.75)
SEG1_ANODE: length 154.5
  Top Layer w0.254: v1(18.67,38.61) 19.43,37.85 26.42,37.85 32.13,32.13 32.13,25.27 33.91,23.5 39.5,23.5 42.16,20.83 53.09,20.83 55.88,23.62 59.06,23.62 v1(64.39,28.96)
  Bottom Layer w0.254: v1(18.67,38.61) 18.16,38.1 18.16,35.81 19.05,34.93 19.05,31.12 16.76,28.83 16.76,12.7 19.05,10.41 LED3.3 ; Q1.1 109.73,30.1 109.73,29.08 111.12,27.69 111.12,23.88 110.62,23.37 107.57,23.37 100.58,30.35 65.79,30.35 v1(64.39,28.96)
SEG2_ANODE: length 123.5
  Top Layer w0.254: v1(46.86,38.23) v1(66.17,38.23)
  Bottom Layer w0.254: v1(46.86,38.23) 45.47,38.23 43.94,36.7 43.94,12.51 51.18,5.27 51.18,3.05 50.37,2.23 44.83,2.23 43.94,3.12 LED4.3 ; Q2.1 107.95,24.38 105.54,26.8 105.54,34.8 102.11,38.23 89.92,38.23 88.52,39.62 67.56,39.62 v1(66.17,38.23)
SEG3_ANODE: length 89.4
  Top Layer w0.254: v1(69.47,36.58) 68.71,35.81 68.71,34.93 ; v1(101.85,14.61) 95,14.61 v1(87.25,6.86) 79.38,14.73 v1(79.38,31.75)
  Bottom Layer w0.254: v1(79.38,31.75) 74.55,36.58 v1(69.47,36.58) ; Q3.1 105.41,14.61 v1(101.85,14.61) ; v1(87.25,6.86) 69.6,6.86 68.71,5.97 LED5.3
SEG4_ANODE: length 54.7
  Top Layer w0.254: v1(93.6,28.7) 93.47,28.83 v1(93.47,31.62) ; LED6.3 93.47,8.38 97.54,12.45 Q4.1
  Bottom Layer w0.254: v1(93.47,31.62) 93.47,34.93 ; v1(93.6,28.7) 94.87,27.43 94.87,20.19 102.62,12.45 Q4.1
SEG_A: length 45.6
  Top Layer w0.254: U19.2 33.02,16.49 31.32,18.19 31.32,31.42 25.53,37.21 18.16,37.21 16,39.37 16,44.07 18.42,46.48 U1.4
SEG_B: length 27.2
  Top Layer w0.254: v1(21.97,39.12) 21.34,39.75 21.34,48.32 U1.5
  Bottom Layer w0.254: v1(21.97,39.12) 23.11,37.97 25.65,37.97 29.97,33.66 U18.2
SEG_C: length 29.8
  Bottom Layer w0.254: U17.2 27.81,28.21 27.81,34.29 24.89,37.21 22.23,37.21 18.92,40.51 18.92,41.66 23.5,46.23 U1.6
SEG_D: length 38
  Bottom Layer w0.254: U16.2 22.86,26.69 25.8,23.75 30.86,23.75 32.16,25.04 32.16,35.43 37.85,41.12 37.85,45.59 36.19,47.24 U1.11
SEG_DP: length 35.6
  Top Layer w0.254: v1(43.31,52.32) 43.81,52.83 U1.15 ; v1(42.42,41.02) 42.55,41.15 42.55,45.09 v1(45.72,48.26)
  Bottom Layer w0.254: v1(42.42,41.02) 36.96,35.56 36.96,29 R6.2 ; v1(43.31,52.32) 43.69,52.32 45.72,50.29 45.72,48.26
SEG_E: length 42.2
  Bottom Layer w0.254: U1.12 38.61,48.58 38.61,40.51 32.64,34.54 32.64,24.89 30.99,23.24 22.37,23.24 U15.2
SEG_F: length 85
  Top Layer w0.254: 15.11,16.36 15.11,14.99 13.34,13.21 6.86,13.21 4.57,15.49 4.57,43.18 8.13,46.74 8.13,50.29 9.14,51.31 v1(27.31,51.31)
  Bottom Layer w0.254: v1(27.31,51.31) 39.5,51.31 41.28,49.53 U1.13
SEG_G: length 57.3
  Top Layer w0.254: 11.68,16.36 15.39,20.07 v1(26.16,20.07)
  Bottom Layer w0.254: U1.14 43.81,48.13 42.67,46.99 40.64,46.99 39.24,45.59 39.24,39.24 35.94,35.94 35.94,22.73 33.27,20.07 v1(26.16,20.07)
$1N511: length 9.3
  Top Layer w0.254: 10.07,44.03 10.67,43.43 10.67,41.93 R1.1 ; 10.07,44.03 SW1.3 ; 10.07,44.03 10.12,44.03 10.8,44.7 U1.1
$1N849: length 14.5
  Top Layer w0.254: X1.2 39.31,43.05 U1.10
  Bottom Layer w0.254: X1.2 44.2,43.05 C2.2
$1N855: length 10.4
  Top Layer w0.254: C1.2 30.48,45.34 31.12,45.97 U1.9
  Bottom Layer w0.254: C1.2 34.51,44.07 X1.1
$1N1319: length 11.7
  Top Layer w0.254: 9V-12V.4 100.86,51.66 96.62,55.91 SW2.1
$1N1324: length 7.3
  Top Layer w0.254: U3.2 94.62,54.01 SW2.2
$1N1483: length 15.2
  Top Layer w0.254: 85.72,47 89.53,43.19 U5.1 ; 85.72,47 85.2,47.52 U4.1 ; 85.72,47 88.61,49.89 U3.1
$1N1989: length 46.2
  Bottom Layer w0.254: R2.1 70.1,47.75 72.14,45.72 82.93,45.72 88.27,40.39 105.16,40.39 LED2.1
$1N2086: length 111.3
  Top Layer w0.254: v1(61.72,30.35) 53.21,21.84 v1(42.8,21.84) ; v1(15.75,18.42) v1(18.92,18.42)
  Bottom Layer w0.254: v1(42.8,21.84) 36.32,21.84 33.53,19.05 22.23,19.05 21.59,18.42 v1(18.92,18.42) ; v1(61.72,30.35) 61.72,36.45 65.53,40.26 74.3,40.26 76.35,42.31 R3.1 ; LED1.1 5.72,44.32 4.57,43.18 4.57,28.7 14.86,18.42 v1(15.75,18.42)
$1N2466: length 10.3
  Top Layer w0.254: U8.2 104.29,31.5 Q1.2
$1N2538: length 8.9
  Top Layer w0.254: U9.2 101.49,25.65 Q2.2
$1N2650: length 9.4
  Top Layer w0.254: Q3.2 106.05,19.81 104.14,21.72 U10.2
$1N2701: length 10.8
  Top Layer w0.254: Q4.2 106.81,13.72 101.85,18.67 U11.2
$1N2822: length 47.7
  Top Layer w0.381: v1(56.52,36.83) 54.74,35.05 v1(52.71,35.05)
  Bottom Layer w0.381: v1(56.52,36.83) 57.15,37.47 57.15,48.9 54.36,51.69 U12.3 ; v1(52.71,35.05) 52.2,34.54 52.2,23.75 54.74,21.21 B1.1
$1N3202: length 9.3
  Top Layer w0.254: U12.2 52.2,54.23 50.42,52.45 50.42,47.67 50.59,47.5
$1N3219: length 12.5
  Top Layer w0.254: X2.1 49.49,54.7 51.56,56.77 U12.1
$1N3541: length 93.8
  Top Layer w0.254: 98.55,4.44 98.55,2.67 97.79,1.91 76.33,1.91 LED5.5 70.61,7.62 50.04,7.62 49.02,6.6 ; LED3.5 25.15,3.43 30.48,3.43 40.26,13.21 40.26,14.73 ; LED4.5 49.02,6.6 ; 49.02,6.6 49.02,7.37 41.66,14.73 40.26,14.73 ; R6.1 39.5,16.47 40.26,15.71 40.26,14.73
$1N3670: length 110.7
  Top Layer w0.254: 63.63,34.93 61.98,33.27 53.21,33.27 49.91,36.58 39.5,36.58 38.86,35.94 38.86,34.93 36.07,34.93 v1(35.18,34.04) ; 13.97,34.93 13.97,32.64 17.02,29.59 17.02,26.04 21.97,21.08 v1(27.43,21.08)
  Bottom Layer w0.254: U13.1 11.68,30.1 13.97,32.39 13.97,34.93 ; 63.63,34.93 63.63,35.56 65.41,37.34 85.98,37.34 88.39,34.93 ; v1(27.43,21.08) 33.15,21.08 35.18,23.11 v1(35.18,34.04)
$1N3781: length 99.5
  Top Layer w0.254: 90.93,34.93 90.93,35.56 v1(89.41,37.08) ; v1(30.35,36.2) 33.66,32.89 39.37,32.89 41.4,34.93 ; 66.17,34.93 66.17,36.2 ; 66.17,36.2 66.17,36.83 65.58,37.41 41.99,37.41 v1(41.91,37.34) ; 66.17,36.2 66.68,36.2 v1(68.45,37.97) ; v1(20.19,40.7) 18.35,40.7 v1(17.34,39.69)
  Bottom Layer w0.254: v1(89.41,37.08) 87.76,38.73 69.22,38.73 v1(68.45,37.97) ; v1(41.91,37.34) 41.78,37.34 41.4,36.96 41.4,34.93 ; v1(17.34,39.69) 16.51,38.86 16.51,30.61 15.11,29.21 U14.1 ; v1(30.35,36.2) 27.81,38.73 24.51,38.73 22.54,40.7 v1(20.19,40.7)
$1N3888: length 96.5
  Top Layer w0.254: LED3.1 13.97,7.62 18.92,12.57 U15.1
  Bottom Layer w0.254: LED6.1 88.39,2.92 87.63,2.16 64.01,2.16 63.63,2.54 63.63,2.67 ; 63.63,2.67 LED5.1 ; 63.63,2.67 62.36,1.4 40.26,1.4 38.86,2.79 LED4.1 37.85,5.46 27.69,5.46 18.92,14.22 U15.1
$1N3982: length 99.2
  Top Layer w0.254: U16.1 22.61,14.22 16.51,8.13 LED3.2 ; LED4.2 41.4,3.18 43.18,1.4 64.39,1.4 66.17,3.18 LED5.2
  Bottom Layer w0.254: U16.1 22.61,14.99 30.35,7.24 40.26,7.24 41.4,6.1 LED4.2 ; LED6.2 90.93,6.1 88.65,8.38 67.94,8.38 66.17,6.6 LED5.2
$1N4031: length 99.3
  Top Layer w0.254: v1(72.39,1.02) 71.25,2.16 LED5.4 71.25,4.57 69.34,6.48 61.09,6.48 56.77,2.16 47.5,2.16 46.48,3.18 LED4.4 ; LED3.4 21.59,10.16 26.29,14.86 U17.1
  Bottom Layer w0.254: v1(72.39,1.02) 94.11,1.02 96.01,2.92 LED6.4 ; U17.1 26.29,14.61 32,8.89 42.04,8.89 LED4.4
$1N4067: length 109.1
  Top Layer w0.254: v1(43.31,39.37) 34.54,39.37 v1(34.42,39.24) ; v1(63.25,31.62) v1(49.91,31.62) ; U18.1 28.7,17.76 28.7,30.35 ; 28.7,30.35 30.23,30.35 v1(30.73,30.86) ; 28.7,30.35 24.13,34.93 ; 73.79,34.93 73.79,36.58 75.69,38.48 95,38.48 98.55,34.93
  Bottom Layer w0.254: v1(30.73,30.86) 31.5,31.62 31.5,36.32 v1(34.42,39.24) ; v1(63.25,31.62) 70.49,31.62 73.79,34.93 ; v1(49.91,31.62) 48.9,32.64 48.9,34.8 49.02,34.93 48.9,35.05 48.9,38.23 47.75,39.37 v1(43.31,39.37)
$1N4099: length 104.5
  Top Layer w0.254: U19.1 34.04,27.56 38.1,31.62 44.83,31.62 46.48,33.27 ; 71.25,33.4 70.61,32.77 46.99,32.77 46.48,33.27 ; 71.25,33.4 71.25,34.93 ; 71.25,33.4 71.25,33.27 71.75,32.77 93.85,32.77 96.01,34.93 ; 46.48,33.27 46.48,34.93
  Bottom Layer w0.254: 21.59,34.93 21.59,31.88 17.4,27.69 17.4,23.11 18.54,21.97 32.39,21.97 34.04,23.62 U19.1

## Copper pours and planes (outline as drawn; the poured copper is in the pictures)
GND on Top Layer: -20.45,70.48 128.78,70.48 128.78,-4.06 -20.45,-4.06
GND on Bottom Layer: -12.7,65.15 119.25,65.15 119.25,-4.95 -12.7,-4.95

Small or netless copper shapes (teardrops, artwork), in the pictures only: 1 on Top Layer

## Text on the board
Bottom Silkscreen Layer: 100kΩ | 100KΩ | 150Ω | 6.8kΩ | Design by | Sultan Mahmud Saad
Top Silkscreen Layer: Reset | 1N4007 | ATMEGA328P-PU | 10kΩ | 22pF | 16MHz | 330Ω | 220uF | 100nF | DS1307+ | LM7805 | 9V-12V | Sultan Mahmud Saad
